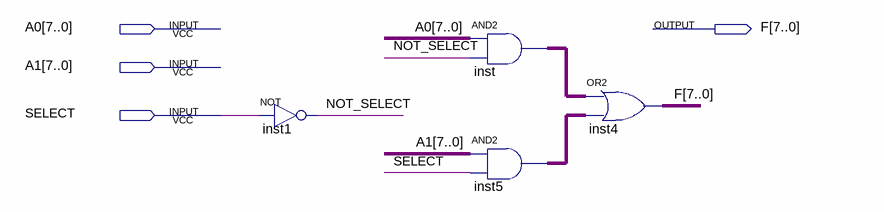
[diagram p0: schematic sheet]
// Quartus schematic MPX2_8.bdf as structural Verilog: 4 symbols, 4 pins
module MPX2_8 (
  input  [7:0] A0,
  input  [7:0] A1,
  input  SELECT,
  output [7:0] F
);

  wire NOT_SELECT;
  wire [7:0] inst5_out, inst_out;

  not inst1 (NOT_SELECT, SELECT);
  assign inst_out = A0 & {8{NOT_SELECT}};  // AND2 inst, 8 bits wide
  assign inst5_out = A1 & {8{SELECT}};  // AND2 inst5, 8 bits wide
  assign F = inst_out | inst5_out;  // OR2 inst4, 8 bits wide
endmodule
